# EAGLE schematic moire_v2.2 (EAGLE 9.1.1)

## Sheet 1 of 2
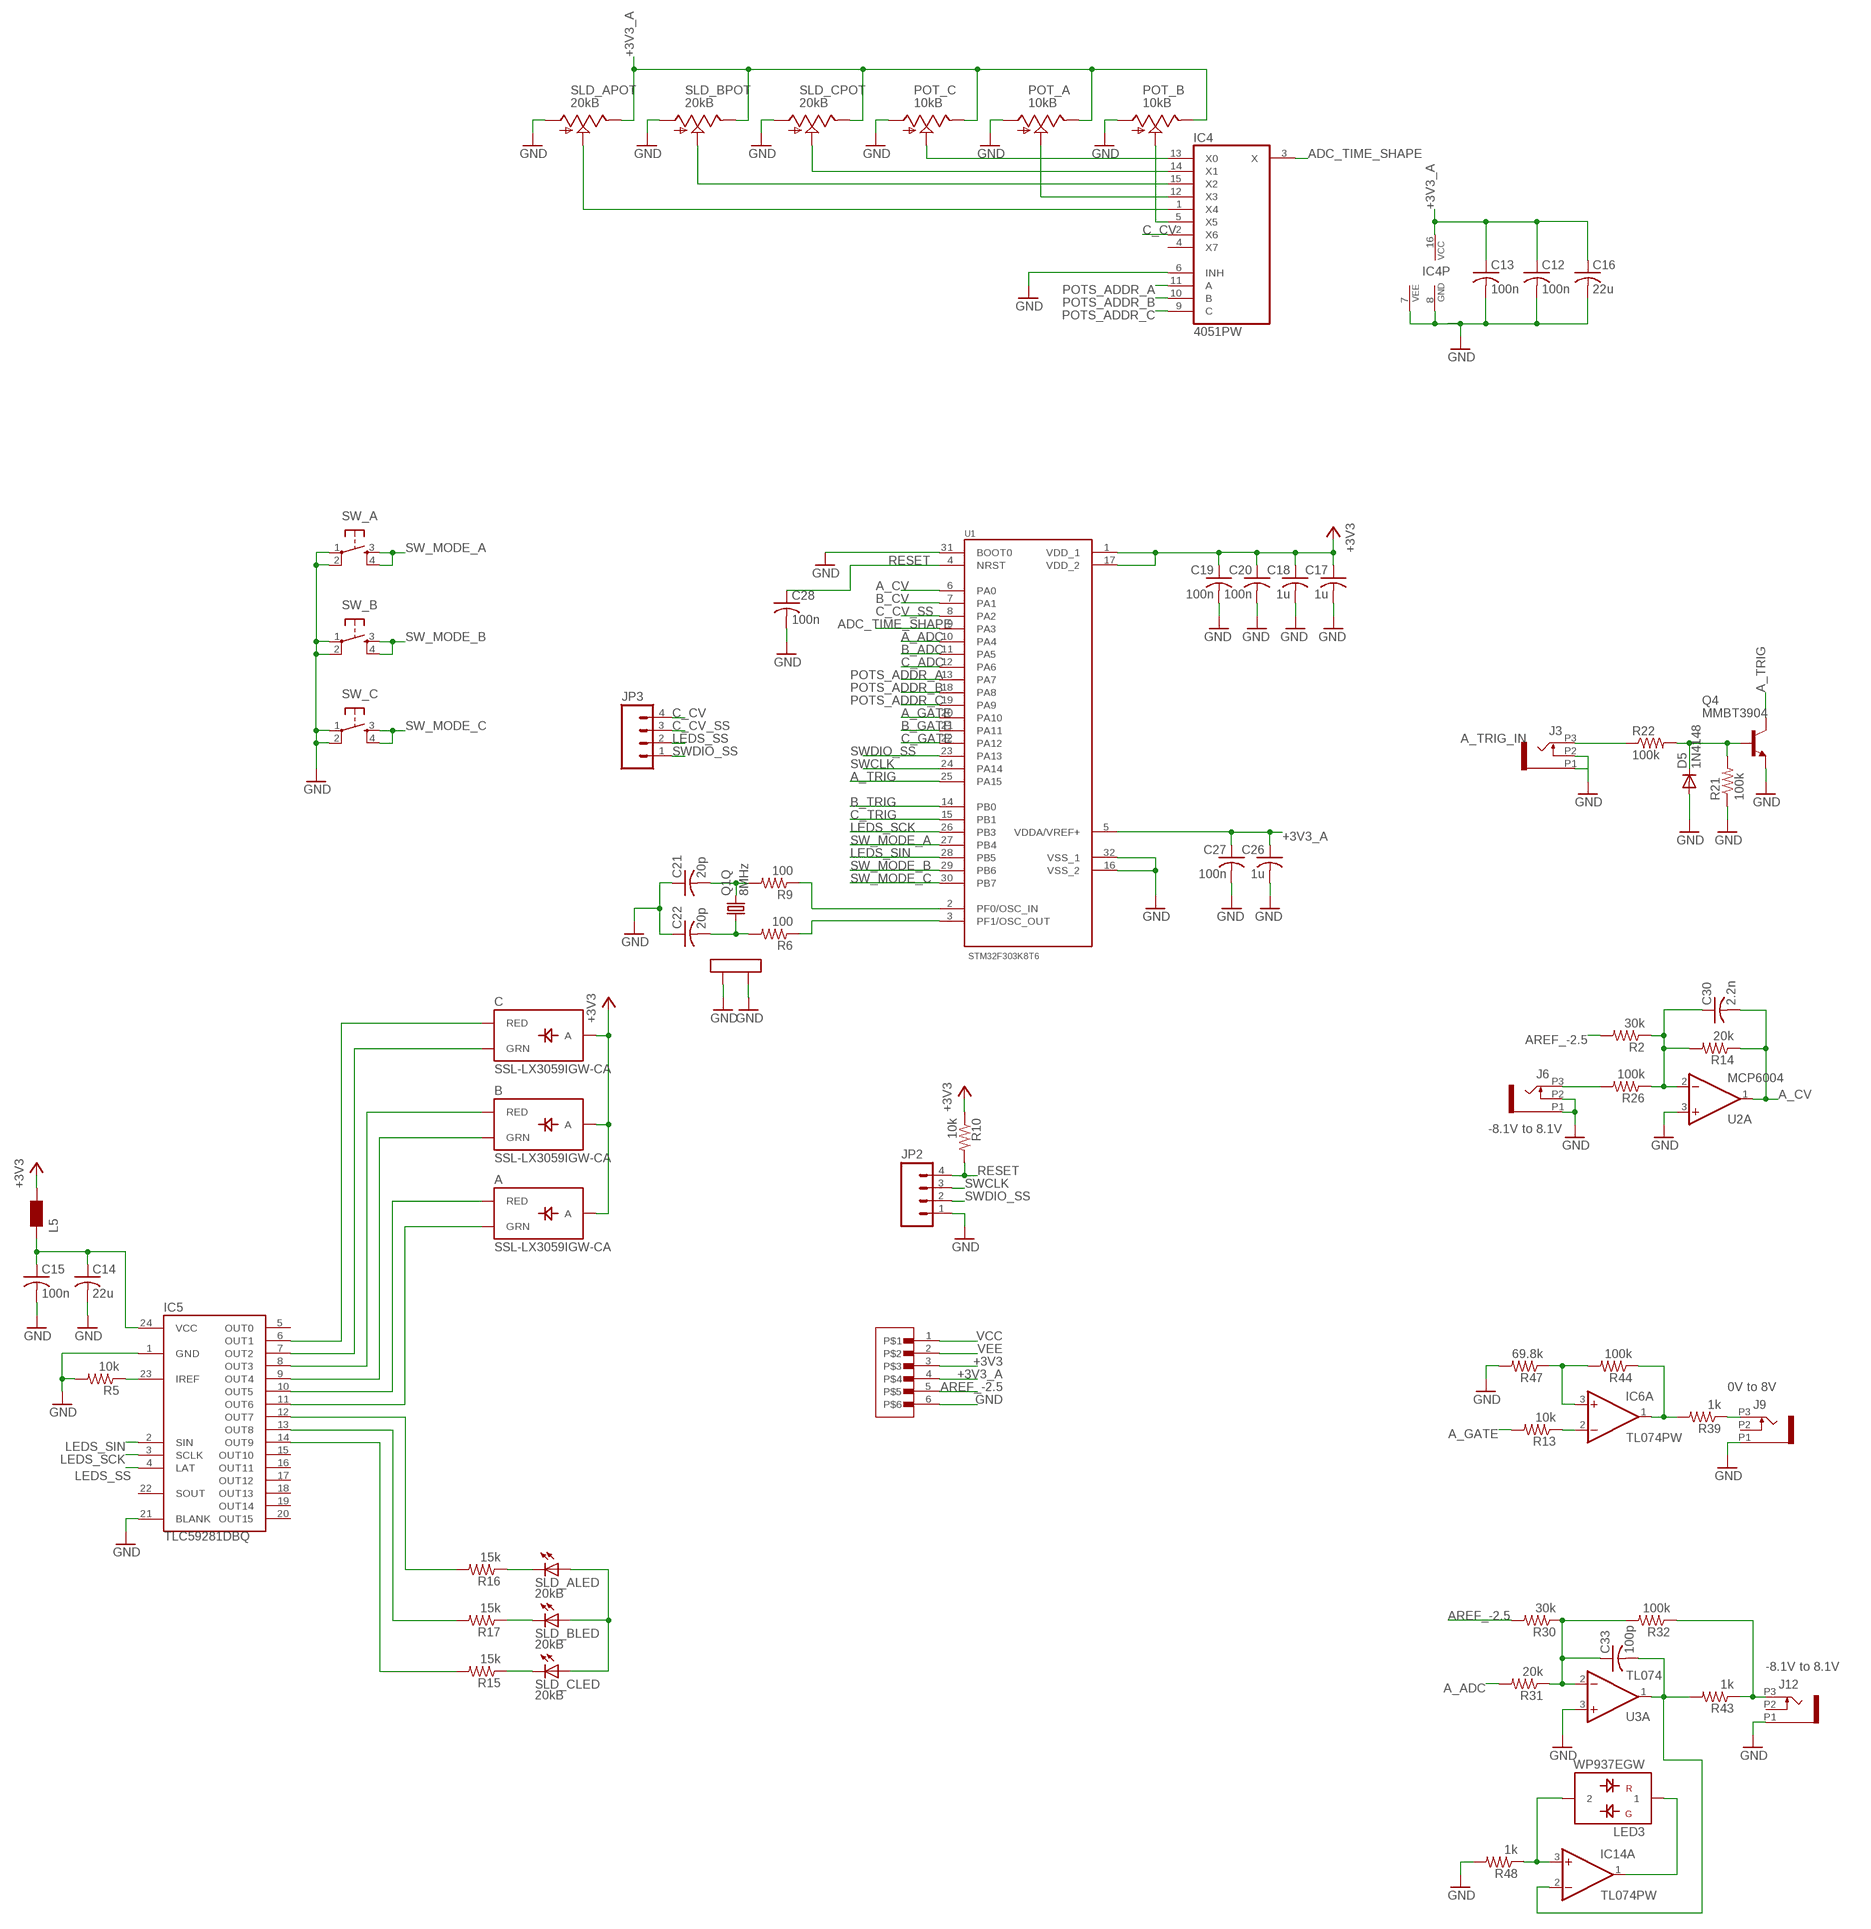
[diagram p0: schematic, sheet 1, part 1 of 2]
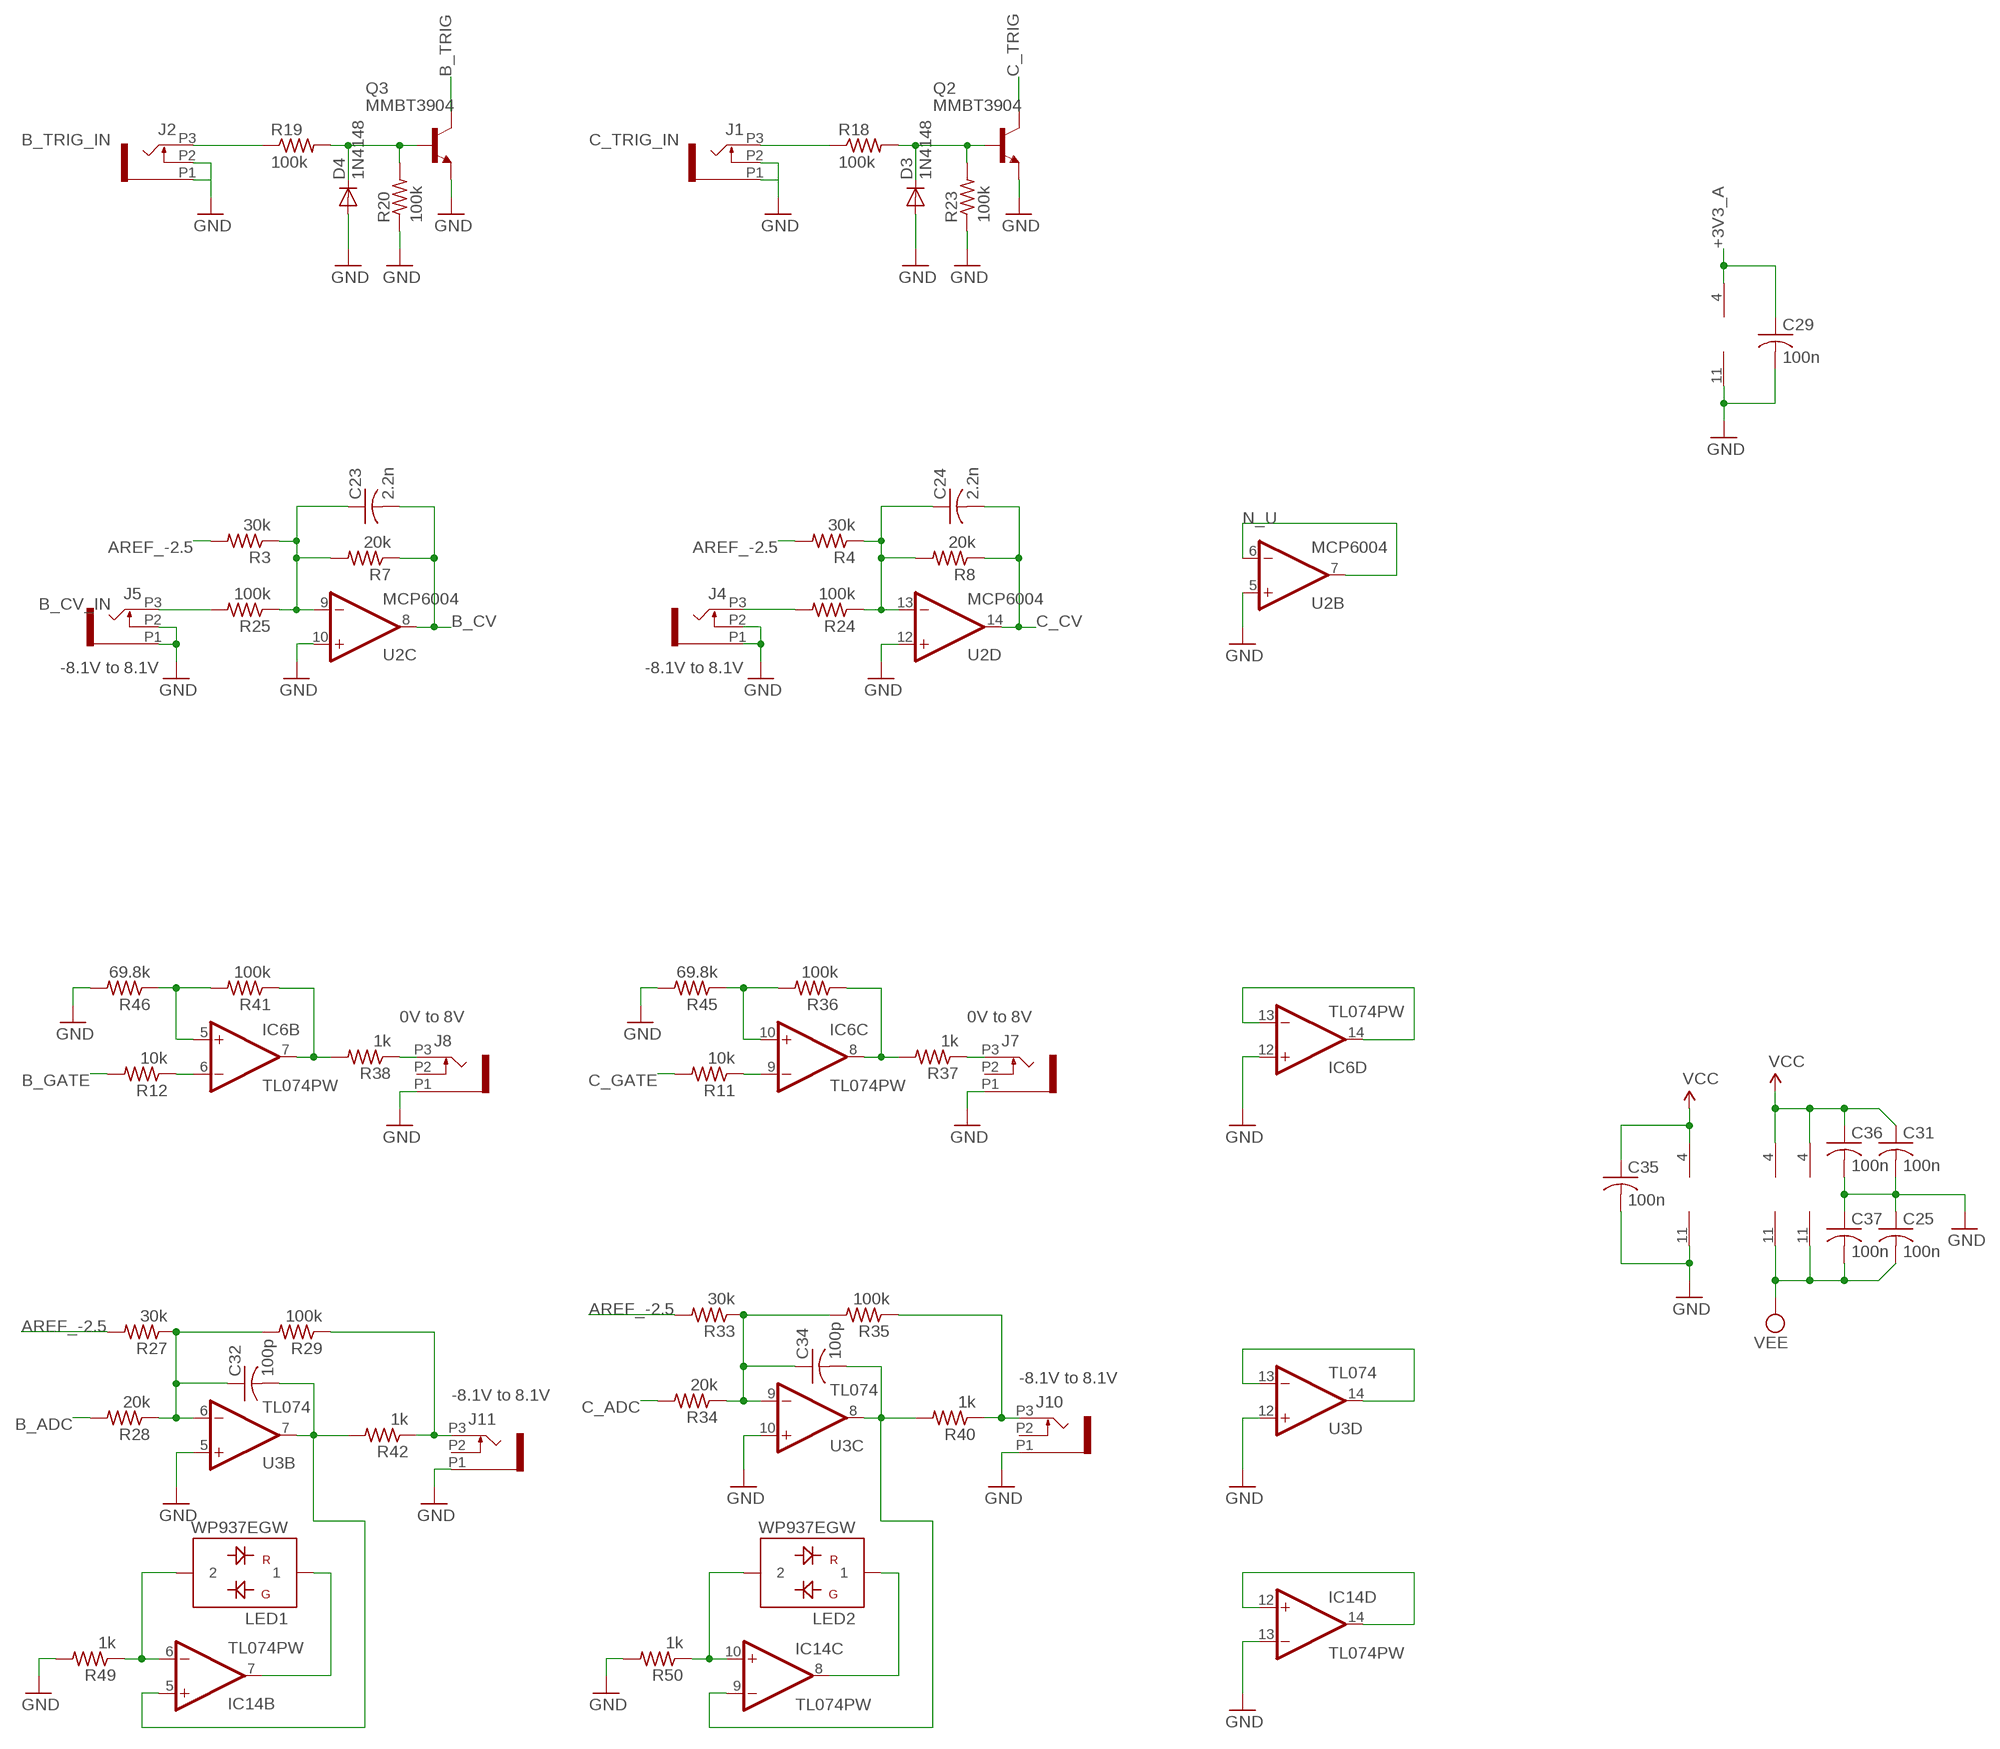
[diagram p1: schematic, sheet 1, part 2 of 2]

### Parts
A  SSL-LX3059IGW-CA  LED-BICOLOR-THROUGHHOLE-CA  [LED-BICOLOR-THROUGHHOLE-LUMEX]
B  SSL-LX3059IGW-CA  LED-BICOLOR-THROUGHHOLE-CA  [LED-BICOLOR-THROUGHHOLE-LUMEX]
C  SSL-LX3059IGW-CA  LED-BICOLOR-THROUGHHOLE-CA  [LED-BICOLOR-THROUGHHOLE-LUMEX]
C12  100n  RCL_C-USC0603  [RCL_C0603]
C13  100n  RCL_C-USC0603  [RCL_C0603]
C14  22u  RCL_C-USC1206  [RCL_C1206]
C15  100n  RCL_C-USC0603  [RCL_C0603]
C16  22u  RCL_C-USC1206  [RCL_C1206]
C17  1u  RCL_C-USC0603  [RCL_C0603]
C18  1u  RCL_C-USC0603  [RCL_C0603]
C19  100n  RCL_C-USC0603  [RCL_C0603]
C20  100n  RCL_C-USC0603  [RCL_C0603]
C21  20p  RCL_C-USC0603  [RCL_C0603]
C22  20p  RCL_C-USC0603  [RCL_C0603]
C23  2.2n  RCL_C-USC0603  [RCL_C0603]
C24  2.2n  RCL_C-USC0603  [RCL_C0603]
C25  100n  RCL_C-USC0603  [RCL_C0603]
C26  1u  RCL_C-USC0603  [RCL_C0603]
C27  100n  RCL_C-USC0603  [RCL_C0603]
C28  100n  RCL_C-USC0603  [RCL_C0603]
C29  100n  RCL_C-USC0603  [RCL_C0603]
C30  2.2n  RCL_C-USC0603  [RCL_C0603]
C31  100n  RCL_C-USC0603  [RCL_C0603]
C32  100p  RCL_C-USC0603  [RCL_C0603]
C33  100p  RCL_C-USC0603  [RCL_C0603]
C34  100p  RCL_C-USC0603  [RCL_C0603]
C35  100n  RCL_C-USC0603  [RCL_C0603]
C36  100n  RCL_C-USC0603  [RCL_C0603]
C37  100n  RCL_C-USC0603  [RCL_C0603]
D3  1N4148  DIODE_DIODE-SOD523  [DIODE_SOD523]
D4  1N4148  DIODE_DIODE-SOD523  [DIODE_SOD523]
D5  1N4148  DIODE_DIODE-SOD523  [DIODE_SOD523]
IC4  4051PW  [TSSOP16_065]
IC5  TLC59281DBQ  [TSSOP24_0635]
IC6  TL074PW  [TSSOP14_065]
IC14  TL074PW  [TSSOP14_065]
J1  PJ301_THONKICONN6  [WQP_PJ_301M6]
J2  PJ301_THONKICONN6  [WQP_PJ_301M6]
J3  PJ301_THONKICONN6  [WQP_PJ_301M6]
J4  PJ301_THONKICONN6  [WQP_PJ_301M6]
J5  PJ301_THONKICONN6  [WQP_PJ_301M6]
J6  PJ301_THONKICONN6  [WQP_PJ_301M6]
J7  PJ301_THONKICONN6  [WQP_PJ_301M6]
J8  PJ301_THONKICONN6  [WQP_PJ_301M6]
J9  PJ301_THONKICONN6  [WQP_PJ_301M6]
J10  PJ301_THONKICONN6  [WQP_PJ_301M6]
J11  PJ301_THONKICONN6  [WQP_PJ_301M6]
J12  PJ301_THONKICONN6  [WQP_PJ_301M6]
JP2  M04PTH  [1X04]
JP3  M04PTH  [1X04]
L5  WE-CBF_0603  [0603]
LED1  WP937EGW  LED-BICOLOR-SHARED-THROUGHHOLE  [LED3MM]
LED2  WP937EGW  LED-BICOLOR-SHARED-THROUGHHOLE  [LED3MM]
LED3  WP937EGW  LED-BICOLOR-SHARED-THROUGHHOLE  [LED3MM]
POT_A  10kB  POT_USVERTICAL  [ALPS_POT_VERTICAL]
POT_B  10kB  POT_USVERTICAL  [ALPS_POT_VERTICAL]
POT_C  10kB  POT_USVERTICAL  [ALPS_POT_VERTICAL]
Q1  8MHz  CRYSTAL  [CTS406]
Q2  MMBT3904  MMBT3904LT1-NPN-SOT23-BEC  [SOT23-BEC]
Q3  MMBT3904  MMBT3904LT1-NPN-SOT23-BEC  [SOT23-BEC]
Q4  MMBT3904  MMBT3904LT1-NPN-SOT23-BEC  [SOT23-BEC]
R2  30k  RCL_R-US_R0603  [RCL_R0603]
R3  30k  RCL_R-US_R0603  [RCL_R0603]
R4  30k  RCL_R-US_R0603  [RCL_R0603]
R5  10k  RCL_R-US_R0603  [RCL_R0603]
R6  100  RCL_R-US_R0603  [RCL_R0603]
R7  20k  RCL_R-US_R0603  [RCL_R0603]
R8  20k  RCL_R-US_R0603  [RCL_R0603]
R9  100  RCL_R-US_R0603  [RCL_R0603]
R10  10k  RCL_R-US_R0603  [RCL_R0603]
R11  10k  RCL_R-US_R0603  [RCL_R0603]
R12  10k  RCL_R-US_R0603  [RCL_R0603]
R13  10k  RCL_R-US_R0603  [RCL_R0603]
R14  20k  RCL_R-US_R0603  [RCL_R0603]
R15  15k  RCL_R-US_R0603  [RCL_R0603]
R16  15k  RCL_R-US_R0603  [RCL_R0603]
R17  15k  RCL_R-US_R0603  [RCL_R0603]
R18  100k  RCL_R-US_R0603  [RCL_R0603]
R19  100k  RCL_R-US_R0603  [RCL_R0603]
R20  100k  RCL_R-US_R0603  [RCL_R0603]
R21  100k  RCL_R-US_R0603  [RCL_R0603]
R22  100k  RCL_R-US_R0603  [RCL_R0603]
R23  100k  RCL_R-US_R0603  [RCL_R0603]
R24  100k  RCL_R-US_R0603  [RCL_R0603]
R25  100k  RCL_R-US_R0603  [RCL_R0603]
R26  100k  RCL_R-US_R0603  [RCL_R0603]
R27  30k  RCL_R-US_R0603  [RCL_R0603]
R28  20k  RCL_R-US_R0603  [RCL_R0603]
R29  100k  RCL_R-US_R0603  [RCL_R0603]
R30  30k  RCL_R-US_R0603  [RCL_R0603]
R31  20k  RCL_R-US_R0603  [RCL_R0603]
R32  100k  RCL_R-US_R0603  [RCL_R0603]
R33  30k  RCL_R-US_R0603  [RCL_R0603]
R34  20k  RCL_R-US_R0603  [RCL_R0603]
R35  100k  RCL_R-US_R0603  [RCL_R0603]
R36  100k  RCL_R-US_R0603  [RCL_R0603]
R37  1k  RCL_R-US_R0603  [RCL_R0603]
R38  1k  RCL_R-US_R0603  [RCL_R0603]
R39  1k  RCL_R-US_R0603  [RCL_R0603]
R40  1k  RCL_R-US_R0603  [RCL_R0603]
R41  100k  RCL_R-US_R0603  [RCL_R0603]
R42  1k  RCL_R-US_R0603  [RCL_R0603]
R43  1k  RCL_R-US_R0603  [RCL_R0603]
R44  100k  RCL_R-US_R0603  [RCL_R0603]
R45  69.8k  RCL_R-US_R0603  [RCL_R0603]
R46  69.8k  RCL_R-US_R0603  [RCL_R0603]
R47  69.8k  RCL_R-US_R0603  [RCL_R0603]
R48  1k  RCL_R-US_R0603  [RCL_R0603]
R49  1k  RCL_R-US_R0603  [RCL_R0603]
R50  1k  RCL_R-US_R0603  [RCL_R0603]
SLD_A  20kB  BOURNS_SLIDER  [BOURNS_SLIDER]
SLD_B  20kB  BOURNS_SLIDER  [BOURNS_SLIDER]
SLD_C  20kB  BOURNS_SLIDER  [BOURNS_SLIDER]
SW_A  TAC_SWITCHPTH  [TACTILE-PTH]
SW_B  TAC_SWITCHPTH  [TACTILE-PTH]
SW_C  TAC_SWITCHPTH  [TACTILE-PTH]
U1  STM32F303K8T6  [QFP80P900X900X160-32N]
U2  MCP6004  MCP6004_SMD  [SO14]
U3  TL074  TL074_SMD  [SO14]
U$1  1X6-SMD-TESTPAD  [6X1-SMD-TESTPAD]

### Nets
+3V3 [power]: A.A B.A C17.1 C18.1 C19.1 C20.1 C.A L5.2 R10.1 U1.1(VDD_1) U1.17(VDD_2) U$1.3 ; also sheet 2
+3V3_A [power]: C12.1 C13.1 C16.1 C26.1 C27.1 C29.1 IC4.16(VCC) POT_A.P$1(E) POT_B.P$1(E) POT_C.P$1(E) SLD_A.3(POT:E) SLD_B.3(POT:E) SLD_C.3(POT:E) U1.5(VDDA/VREF+) U2.4(P:V+) U$1.4 ; also sheet 2
A_ADC: R31.2 U1.10(PA4)
A_CV: C30.2 R14.1 U1.6(PA0) U2.1(A:OUT)
A_GATE: R13.2 U1.20(PA10)
A_TRIG: Q4.C U1.25(PA15)
A_TRIG_IN: J3.P3 R22.1
ADC_TIME_SHAPE: IC4.3(X) U1.9(PA3)
AREF_-2.5: R2.2 R3.2 R4.2 R27.2 R30.2 R33.2 U$1.5 ; also sheet 2
B_ADC: R28.2 U1.11(PA5)
B_CV: C23.2 R7.1 U1.7(PA1) U2.8(C:OUT)
B_CV_IN: J5.P3 R25.2
B_GATE: R12.2 U1.21(PA11)
B_TRIG: Q3.C U1.14(PB0)
B_TRIG_IN: J2.P3 R19.1
C_ADC: R34.2 U1.12(PA6)
C_CV: C24.2 IC4.2(X6) JP3.4 R8.1 U2.14(D:OUT)
C_CV_SS: JP3.3 U1.8(PA2)
C_GATE: R11.2 U1.22(PA12)
C_TRIG: Q2.C U1.15(PB1)
C_TRIG_IN: J1.P3 R18.1
GND: C12.2 C13.2 C14.2 C15.2 C16.2 C17.2 C18.2 C19.2 C20.2 C21.1 C22.1 C25.1 C26.2 C27.2 C28.2 C29.2 C31.2 C35.2 C36.2 C37.1 D3.A D4.A D5.A IC4.6(INH) IC4.7(VEE) IC4.8(GND) IC5.1(GND) IC5.21(BLANK) IC6.11(P:V-) IC6.12(D:+IN) IC14.13(D:-IN) J1.P1 J1.P2 J2.P1 J2.P2 J3.P1 J3.P2 J4.P1 J4.P2 J5.P1 J5.P2 J6.P1 J6.P2 J7.P1 J8.P1 J9.P1 J10.P1 J11.P1 J12.P1 JP2.1 POT_A.P$3(A) POT_B.P$3(A) POT_C.P$3(A) Q1.2(LID1) Q1.4(LID2) Q2.E Q3.E Q4.E R5.2 R20.1 R21.1 R23.1 R45.2 R46.2 R47.2 R48.2 R49.2 R50.2 SLD_A.1(POT:A) SLD_B.1(POT:A) SLD_C.1(POT:A) SW_A.1 SW_A.2 SW_B.1 SW_B.2 SW_C.1 SW_C.2 U1.16(VSS_2) U1.31(BOOT0) U1.32(VSS_1) U2.3(A:+IN) U2.5(B:+IN) U2.10(C:+IN) U2.11(P:V-) U2.12(D:+IN) U3.3(A:+IN) U3.5(B:+IN) U3.10(C:+IN) U3.12(D:+IN) U$1.6 ; also sheet 2
LEDS_SCK: IC5.3(SCLK) U1.26(PB3)
LEDS_SIN: IC5.2(SIN) U1.28(PB5)
LEDS_SS: IC5.4(LAT) JP3.2
N$1: R15.1 SLD_C.E(LED:C)
N$2: J9.P3 R39.1
N$6: IC6.13(D:-IN) IC6.14(D:OUT)
N$7: J11.P3 R29.1 R42.1
N$8: C32.1 R27.1 R28.1 R29.2 U3.6(B:-IN)
N$9: R9.1 U1.2(PF0/OSC_IN)
N$10: R6.1 U1.3(PF1/OSC_OUT)
N$11: C21.2 Q1.3 R9.2
N$12: C22.2 Q1.1 R6.2
N$13: J8.P3 R38.1
N$14: U3.13(D:-IN) U3.14(D:OUT)
N$15: C32.2 IC14.5(B:+IN) R42.2 U3.7(B:OUT)
N$16: IC6.1(A:OUT) R39.2 R44.1
N$17: J10.P3 R35.1 R40.1
N$18: C34.1 R33.1 R34.1 R35.2 U3.9(C:-IN)
N$19: C34.2 IC14.9(C:-IN) R40.2 U3.8(C:OUT)
N$20: J7.P3 R37.1
N$21: J4.P3 R24.2
N$22: J6.P3 R26.2
N$24: IC6.3(A:+IN) R44.2 R47.1
N$25: IC6.2(A:-IN) R13.1
N$26: IC6.7(B:OUT) R38.2 R41.1
N$27 [power]: SLD_A.B(LED:A) SLD_B.B(LED:A) SLD_C.B(LED:A)
N$28: IC6.5(B:+IN) R41.2 R46.1
N$29: IC6.6(B:-IN) R12.1
N$30: IC6.8(C:OUT) R36.1 R37.2
N$31: IC14.12(D:+IN) IC14.14(D:OUT)
N$32: C.RED_C(RED) IC5.6(OUT1)
N$33: C.GREEN_C(GRN) IC5.7(OUT2)
N$34: B.RED_C(RED) IC5.8(OUT3)
N$35: B.GREEN_C(GRN) IC5.9(OUT4)
N$36: A.RED_C(RED) IC5.10(OUT5)
N$37: A.GREEN_C(GRN) IC5.11(OUT6)
N$38: IC5.12(OUT7) R16.2
N$39: IC5.13(OUT8) R17.2
N$40: IC14.6(B:-IN) LED1.2 R49.1
N$41: D3.C Q2.B R18.2 R23.2
N$42: IC14.7(B:OUT) LED1.1
N$43: IC5.14(OUT9) R15.2
N$44: C14.1 C15.1 IC5.24(VCC) L5.1
N$48: IC4.1(X4) SLD_A.2(POT:S)
N$49: R17.1 SLD_B.E(LED:C)
N$50: R16.1 SLD_A.E(LED:C)
N$51: IC4.5(X5) POT_B.P$2(S)
N$52: IC14.10(C:+IN) LED2.2 R50.1
N$53: IC4.12(X3) POT_A.P$2(S)
N$54: IC4.13(X0) POT_C.P$2(S)
N$55: IC4.14(X1) SLD_C.2(POT:S)
N$56: IC4.15(X2) SLD_B.2(POT:S)
N$57: C30.1 R2.1 R14.2 R26.1 U2.2(A:-IN)
N$58: C23.1 R3.1 R7.2 R25.1 U2.9(C:-IN)
N$59: C24.1 R4.1 R8.2 R24.1 U2.13(D:-IN)
N$60: IC14.8(C:OUT) LED2.1
N$61: IC6.10(C:+IN) R36.2 R45.1
N$62: D4.C Q3.B R19.2 R20.2
N$64: IC6.9(C:-IN) R11.1
N$65: D5.C Q4.B R21.2 R22.2
N$68: IC5.23(IREF) R5.1
N$84: IC14.3(A:+IN) LED3.2 R48.1
N$85: IC14.1(A:OUT) LED3.1
N$86: J12.P3 R32.1 R43.1
N$87: C33.1 R30.1 R31.1 R32.2 U3.2(A:-IN)
N$93: C33.2 IC14.2(A:-IN) R43.2 U3.1(A:OUT)
N_U: U2.6(B:-IN) U2.7(B:OUT)
POTS_ADDR_A: IC4.11(A) U1.13(PA7)
POTS_ADDR_B: IC4.10(B) U1.18(PA8)
POTS_ADDR_C: IC4.9(C) U1.19(PA9)
RESET: C28.1 JP2.4 R10.2 U1.4(NRST)
SW_MODE_A: SW_A.3 SW_A.4 U1.27(PB4)
SW_MODE_B: SW_B.3 SW_B.4 U1.29(PB6)
SW_MODE_C: SW_C.3 SW_C.4 U1.30(PB7)
SWCLK: JP2.3 U1.24(PA14)
SWDIO_SS: JP2.2 JP3.1 U1.23(PA13)
VCC [vcc-vee]: C31.1 C35.1 C36.1 IC6.4(P:V+) IC14.4(P:V+) U3.4(P:V+) U$1.1 ; also sheet 2
VEE [vcc-vee]: C25.2 C37.2 IC14.11(P:V-) U3.11(P:V-) U$1.2 ; also sheet 2
Unconnected: IC4.4(X7) IC5.5(OUT0) IC5.15(OUT10) IC5.16(OUT11) IC5.17(OUT12) IC5.18(OUT13) IC5.19(OUT14) IC5.20(OUT15) IC5.22(SOUT) J7.P2 J8.P2 J9.P2 J10.P2 J11.P2 J12.P2

### Notes on the sheet
- -8.1V to 8.1V | -8.1V to 8.1V | -8.1V to 8.1V
- 0V to 8V | 0V to 8V | 0V to 8V
- -8.1V to 8.1V
- -8.1V to 8.1V | -8.1V to 8.1V

## Sheet 2 of 2
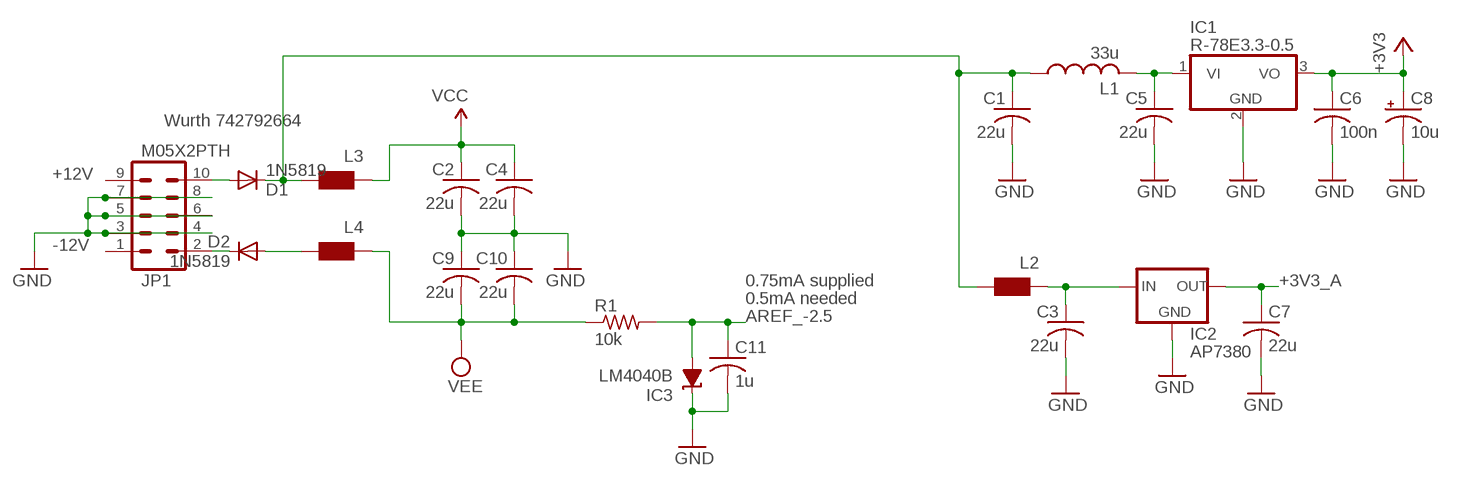
[diagram p2: schematic, sheet 2]

### Parts
C1  22u  RCL_C-USC1206  [RCL_C1206]
C2  22u  RCL_C-USC1206  [RCL_C1206]
C3  22u  RCL_C-USC1206  [RCL_C1206]
C4  22u  RCL_C-USC1206  [RCL_C1206]
C5  22u  RCL_C-USC1206  [RCL_C1206]
C6  100n  RCL_C-USC0603  [RCL_C0603]
C7  22u  RCL_C-USC1206  [RCL_C1206]
C8  10u  RCL_CPOL-USA  [RCL_PANASONIC_A]
C9  22u  RCL_C-USC1206  [RCL_C1206]
C10  22u  RCL_C-USC1206  [RCL_C1206]
C11  1u  RCL_C-USC0603  [RCL_C0603]
D1  1N5819  DIODE_DIODE-SOD123  [DIODE_SOD123]
D2  1N5819  DIODE_DIODE-SOD123  [DIODE_SOD123]
IC1  R-78E3.3-0.5  WE173950378  [WE78]
IC2  AP7380  [SOT89]
IC3  LM4040B  LM4041B12DBZ  [DBZ_R-PDSO-G3]
JP1  M05X2PTH  [2X5-PTH]
L1  33u  L-USL2012C  [L2012C]
L2  WE-CBF_0603  [0603]
L3  WE-CBF_0603  [0603]
L4  WE-CBF_0603  [0603]
R1  10k  RCL_R-US_R0603  [RCL_R0603]

### Nets
+3V3 [power]: C6.1 C8.+ IC1.3(VO) ; also sheet 1
+3V3_A [power]: C7.1 IC2.3(OUT) ; also sheet 1
+12V [power]: D1.A JP1.9 JP1.10
-12V [power]: D2.C JP1.1 JP1.2
AREF_-2.5: C11.1 IC3.2(A) R1.2 ; also sheet 1
GND: C1.2 C2.2 C3.2 C4.2 C5.2 C6.2 C7.2 C8.- C9.1 C10.1 C11.2 IC1.2(GND) IC2.1(GND) IC3.1(C) JP1.3 JP1.4 JP1.5 JP1.6 JP1.7 JP1.8 ; also sheet 1
N$3: D2.A L4.2
N$4: C1.1 D1.C L1.1 L2.2 L3.2
N$5: C3.1 IC2.2(IN) IC2.4(IN) L2.1
N$66: C5.1 IC1.1(VI) L1.2
VCC [vcc-vee]: C2.1 C4.1 L3.1 ; also sheet 1
VEE [vcc-vee]: C9.2 C10.2 L4.1 R1.1 ; also sheet 1

### Notes on the sheet
- Wurth 742792664
- 0.75mA supplied
- 0.5mA needed

## Library data of the parts
A B C = og-leds:LED-BICOLOR-THROUGHHOLE-CA
C1-C7 C9-C37 = moire_v1.5-routed:RCL_C-US: CAPACITOR, American symbol
C8 = moire_v1.5-routed:RCL_CPOL-US: POLARIZED CAPACITOR, American symbol
D1-D5 = moire_v1.7:DIODE_DIODE-: DIODE
IC1 = og-vreg:WE173950378
IC2 = v-reg-custom:AP7380
IC3 = texas:LM4041: PRECISION MICROPOWER SHUNT VOLTAGE REFERENCE Source: http://focus.ti.com/lit/ds/slcs146e/slcs146e.pdf
IC4 = og-ics:4051: 8-channel ANALOG MULTIPLEXER
IC5 = og-ics:TLC59281
IC6 = og-linear:TL074: OP AMP
IC14 = linear:TL074: OP AMP
J1-J12 = og-pj301_variations:PJ301_THONKICONN
JP1 = og-header:M05X2: Header 5x2 Standard 10-pin dual row 0.1" header. Commonly used with AVR-ISP. Use with Spark Fun Electronics SKU: PRT-00778
JP2 JP3 = SparkFun:M04: Header 4 Standard 4-pin 0.1" header. Use with straight break away headers (SKU : PRT-00116), right angle break away headers (PRT-00553), swiss pins (PRT-00743), machine pins (PRT-00117), and female headers (PRT-00115). Molex polarized connector foot print use with SKU : PRT-08231 with associated crimp pins and housings.
L1 = og-rcl:L-US
L2-L5 = wuerth-elektronik:WE-CBF: SMD EMI Suppression Ferrite Beads - excellent anti-EMI properties - low DCR - impedances till 3000 ohms - rated current up to 6 A
LED1-LED3 = og-leds:LED-BICOLOR-SHARED-THROUGHHOLE
POT_A POT_B POT_C = og-pots:POT_US
Q1 = og-crystal:CRYSTAL: Crystal with 2 extra terminals for the metal LID (Abracon ABMM2 for example)
Q2-Q4 = transistor:*-NPN-: NPN Transistror BF959 corrected 2008.03.06
R1-R50 = moire_v1.5-routed:RCL_R-US_: RESISTOR, American symbol
SLD_A SLD_B SLD_C = og-pots:BOURNS_SLIDER
SW_A SW_B SW_C = SparkFun:TAC_SWITCH: Momentary Switch Button commonly used for reset or general input. Spark Fun Electronics SKU : COM-00097
U1 = STM32F303K8T6:STM32F303K8T6: Analog and DSP with FPU ARM Cortex-M4 MCU with 64 Kbytes Flash, 72 MHz CPU, CCM, 12-bit ADC 5 MSPS, comparators, op-amp; AVAILABILITY: Unavailable; DESCRIPTION: Analog and DSP with FPU ARM Cortex-M4 MCU with 64 Kbytes Flash, 72 MHz CPU, CCM, 12-bit ADC 5 MSPS, comparators, op-amp; MF: STMicroelectronics; MP: STM32F303K8T6; PACKAGE: LQFP-32 STMicroelectronics; PRICE: None
U2 = MusicThingModular:MCP6004: Generic Quad Op Amp
U3 = MusicThingModular:TL074: Generic Quad Op Amp
U$1 = CUSTOM:1X6-SMD-TESTPAD

## Net classes
1 power: width 0.406 mm